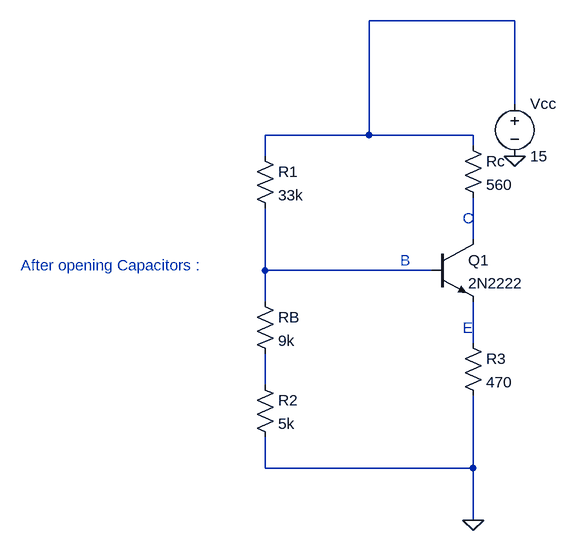
[diagram p0: schematic Step2_afteropeningcapacitors.asc]
Step2_afteropeningcapacitors.asc, the LTspice schematic file:
Version 4
SHEET 1 880 680
WIRE 288 -384 64 -384
WIRE 288 -256 288 -384
WIRE 64 -208 64 -384
WIRE 64 -208 -96 -208
WIRE 224 -208 64 -208
WIRE 224 -192 224 -208
WIRE -96 -176 -96 -208
WIRE 224 -48 224 -112
WIRE -96 0 -96 -96
WIRE 160 0 -96 0
WIRE -96 48 -96 0
WIRE 224 112 224 48
WIRE -96 176 -96 128
WIRE -96 304 -96 256
WIRE 224 304 224 192
WIRE 224 304 -96 304
WIRE 224 384 224 304
FLAG 224 384 0
FLAG 288 -176 0
SYMBOL res -112 -192 R0
SYMATTR InstName R1
SYMATTR Value 33k
SYMBOL res -112 160 R0
SYMATTR InstName R2
SYMATTR Value 5k
SYMBOL res 208 96 R0
SYMATTR InstName R3
SYMATTR Value 470
SYMBOL res -112 32 R0
SYMATTR InstName RB
SYMATTR Value 9k
SYMBOL res 208 -208 R0
SYMATTR InstName Rc
SYMATTR Value 560
SYMBOL npn 160 -48 R0
SYMATTR InstName Q1
SYMATTR Value 2N2222
SYMBOL voltage 288 -272 R0
SYMATTR InstName Vcc
SYMATTR Value 15
TEXT 208 88 Left 2 ;E
TEXT 112 -16 Left 2 ;B
TEXT 208 -80 Left 2 ;C
TEXT -472 -8 Left 2 ;After opening Capacitors :

The netlist it stands for:
* Step2_afteropeningcapacitors.asc
R1 N001 N003 33k
R2 N005 0 5k
R3 N004 0 470
RB N003 N005 9k
Rc N001 N002 560
Q1 N002 N003 N004 0 2N2222
Vcc N001 0 15
.model NPN NPN
.model PNP PNP
.lib standard.bjt
* E
* B
* C
* After opening Capacitors :
.backanno
.end